# EAGLE design PassiveLPG (EAGLE 8.0.2)
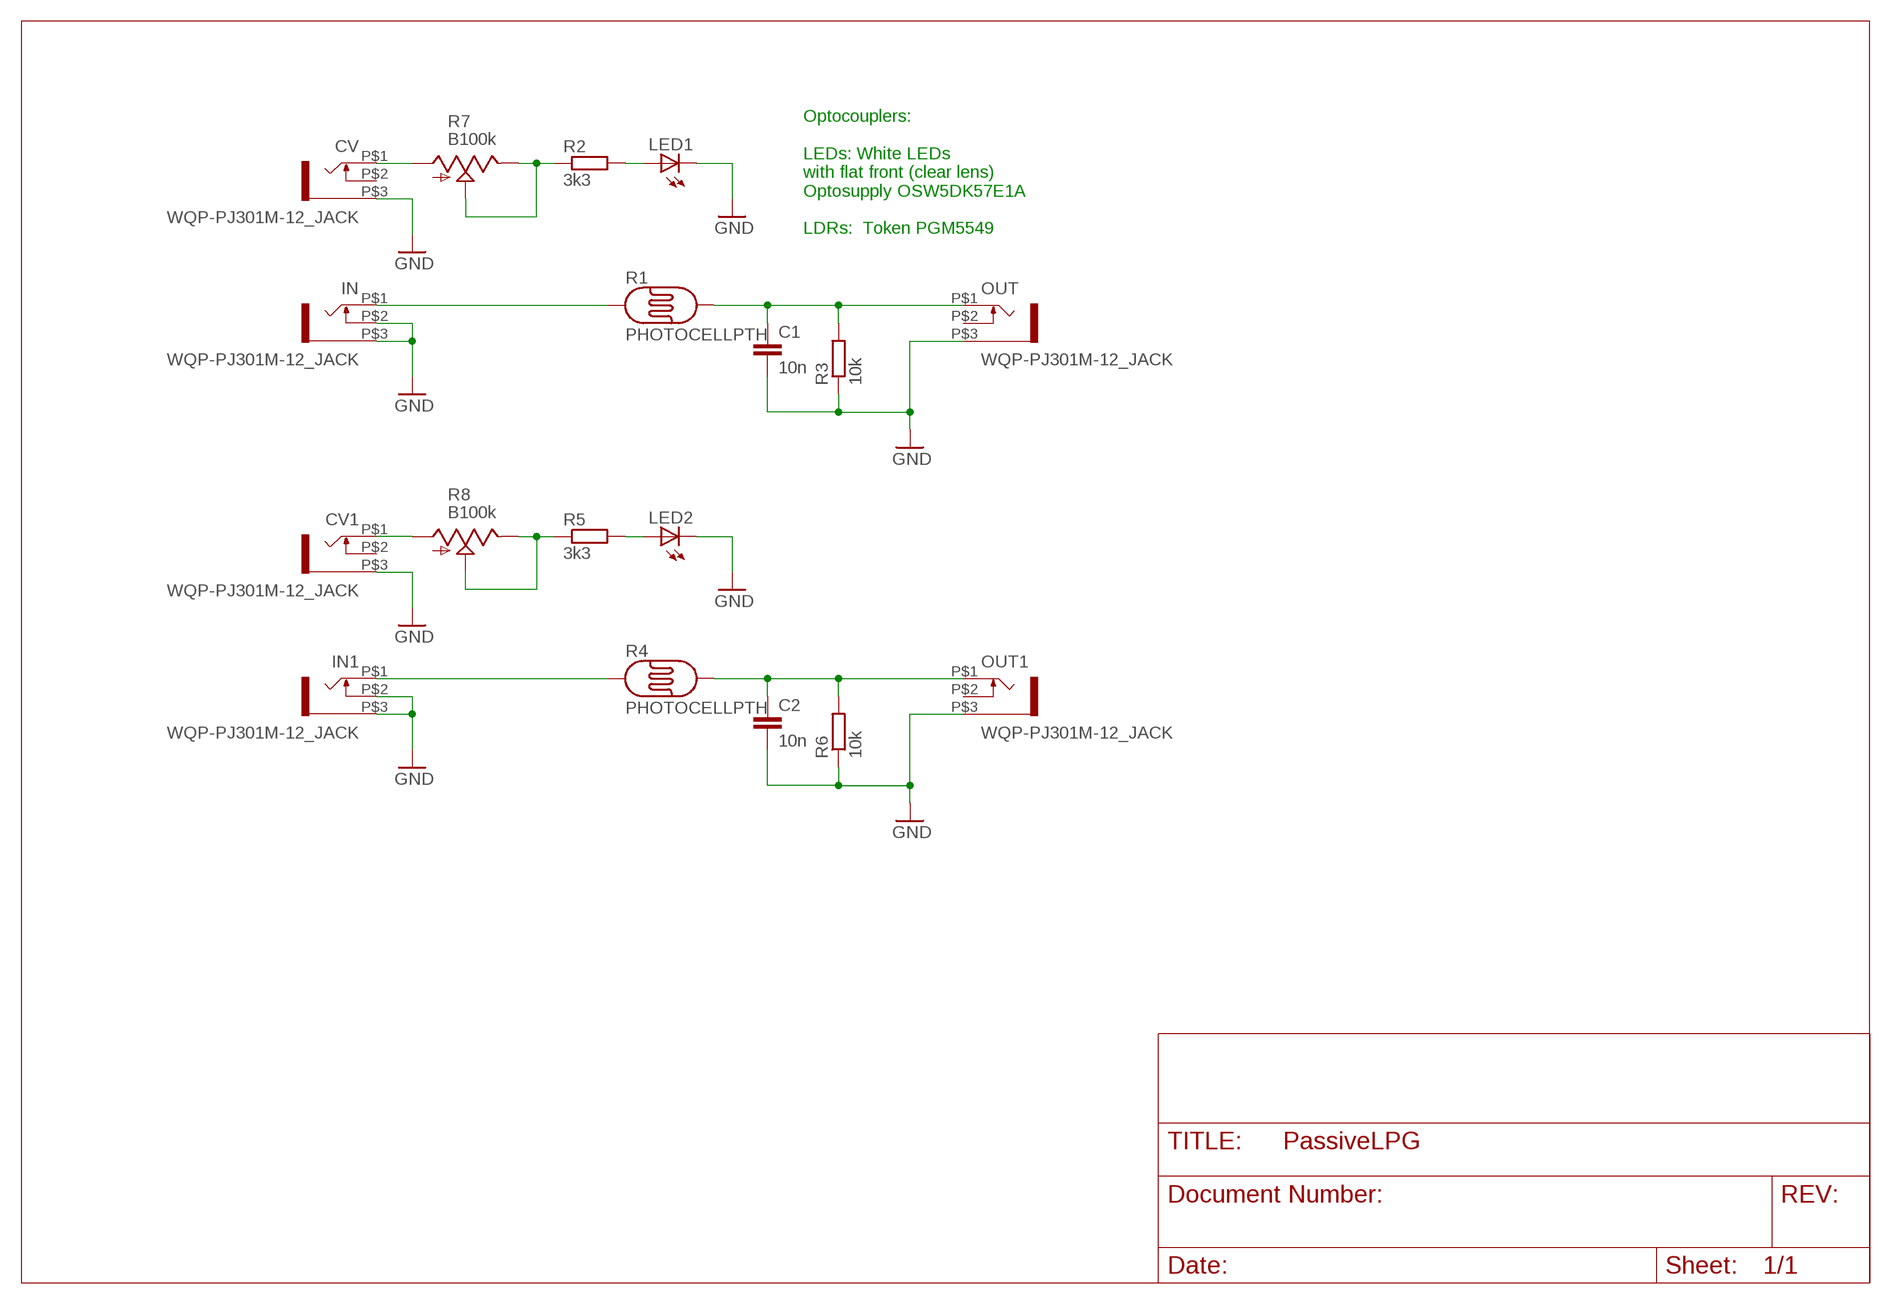
[diagram p0: schematic, sheet 1]

## Parts
C1  10n  C-EU050-025X075  [C050-025X075]
C2  10n  C-EU050-025X075  [C050-025X075]
CV  WQP-PJ301M-12_JACK  [WQP-PJ301M-12_JACK]
CV1  WQP-PJ301M-12_JACK  [WQP-PJ301M-12_JACK]
IN  WQP-PJ301M-12_JACK  [WQP-PJ301M-12_JACK]
IN1  WQP-PJ301M-12_JACK  [WQP-PJ301M-12_JACK]
LED1  LED5MM  [LED5MM]
LED2  LED5MM  [LED5MM]
OUT  WQP-PJ301M-12_JACK  [WQP-PJ301M-12_JACK]
OUT1  WQP-PJ301M-12_JACK  [WQP-PJ301M-12_JACK]
R1  PHOTOCELLPTH  [PHOTOCELL]
R2  3k3  R-EU_0207/7  [0207/7]
R3  10k  R-EU_0207/7  [0207/7]
R4  PHOTOCELLPTH  [PHOTOCELL]
R5  3k3  R-EU_0207/7  [0207/7]
R6  10k  R-EU_0207/7  [0207/7]
R7  B100k  POT_USVERTICAL  [ALPS_POT_VERTICAL]
R8  B100k  POT_USVERTICAL  [ALPS_POT_VERTICAL]

## Nets
GND: C1.2 C2.2 CV1.P$3 CV.P$3 IN1.P$2 IN1.P$3 IN.P$2 IN.P$3 LED1.K(C) LED2.K(C) OUT1.P$3 OUT.P$3 R3.1 R6.1
N$1: CV.P$1 R7.P$3(A)
N$2: R2.1 R7.P$1(E) R7.P$2(S)
N$4: IN.P$1 R1.1
N$5: C1.1 OUT.P$1 R1.2 R3.2
N$6: LED1.A R2.2
N$7: IN1.P$1 R4.1
N$8: C2.1 OUT1.P$1 R4.2 R6.2
N$9: R5.1 R8.P$1(E) R8.P$2(S)
N$10: CV1.P$1 R8.P$3(A)
N$11: LED2.A R5.2
Unconnected: CV1.P$2 CV.P$2 OUT1.P$2 OUT.P$2

## Notes on the sheet
- Optocouplers:
  
  LEDs: White LEDs
  with flat front (clear lens)
  Optosupply OSW5DK57E1A
  
  LDRs:  Token PGM5549

## Library data of the parts
C1 C2 = rcl:C-EU: CAPACITOR, European symbol
CV CV1 IN IN1 OUT OUT1 = thonkiconn:WQP-PJ301M-12_JACK
LED1 LED2 = led:LED: LED OSRAM: - CHIPLED LG R971, LG N971, LY N971, LG Q971, LY Q971, LO R971, LY R971 LH N974, LH R974 LS Q976, LO Q976, LY Q976 LO Q996 - Hyper CHIPLED LW Q18S LB Q993, LB Q99A, LB R99A - SideLED LS A670, LO A670, LY A670, LG A670, LP A670 LB A673, LV A673, LT A673, LW A673 LH A674 LY A675 LS A676, LA A676, LO A676, LY A676, LW A676 LS A679, LY A679, LG A679 - Hyper Micro SIDELED® LS Y876, LA Y876, LO Y876, LY Y876 LT Y87S - SmartLED LW L88C, LW L88S LB L89C, LB L89S, LG L890 LS L89K, LO L89K, LY L89K LS L896, LA L896, LO L896, LY L896 - TOPLED LS T670, LO T670, LY T670, LG T670, LP T670 LSG T670, LSP T670, LSY T670, LOP T670, LYG T670 LG T671, LOG T671, LSG T671 LB T673, LV T673, LT T673, LW T673 LH T674 LS T676, LA T676, LO T676, LY T676, LB T676, LH T676, LSB T676, LW T676 LB T67C, LV T67C, LT T67C, LS T67K, LO T67K, LY T67K, LW E67C LS E67B, LA E67B, LO E67B, LY E67B, LB E67C, LV E67C, LT E67C LW T67C LS T679, LY T679, LG T679 LS T770, LO T770, LY T770, LG T770, LP T770 LB T773, LV T773, LT T773, LW T773 LH T774 LS E675, LA E675, LY E675, LS T675 LS T776, LA T776, LO T776, LY T776, LB T776 LHGB T686 LT T68C, LB T68C - Hyper Mini TOPLED® LB M676 - Mini TOPLED Santana® LG M470 LS M47K, LO M47K, LY M47K Source: http://www.osram.convergy.de LUXEON: - LUMILED® LXK2-PW12-R00, LXK2-PW12-S00, LXK2-PW14-U00, LXK2-PW14-V00 LXK2-PM12-R00, LXK2-PM12-S00, LXK2-PM14-U00 LXK2-PE12-Q00, LXK2-PE12-R00, LXK2-PE12-S00, LXK2-PE14-T00, LXK2-PE14-U00 LXK2-PB12-K00, LXK2-PB12-L00, LXK2-PB12-M00, LXK2-PB14-N00, LXK2-PB14-P00, LXK2-PB14-Q00 LXK2-PR12-L00, LXK2-PR12-M00, LXK2-PR14-Q00, LXK2-PR14-R00 LXK2-PD12-Q00, LXK2-PD12-R00, LXK2-PD12-S00 LXK2-PH12-R00, LXK2-PH12-S00 LXK2-PL12-P00, LXK2-PL12-Q00, LXK2-PL12-R00 Source: www.luxeon.com KINGBRIGHT: KA-3528ASYC Source: www.kingbright.com
R1 R4 = SparkFun-Sensors:PHOTOCELL: CdS photoresistor. This is a low cost way to detect light levels. Resistance decreases with more incoming light. SparkFun SKU: SEN-09088
R2 R3 R5 R6 = rcl:R-EU_: RESISTOR, European symbol
R7 R8 = pot-alps:POT_US

## Board
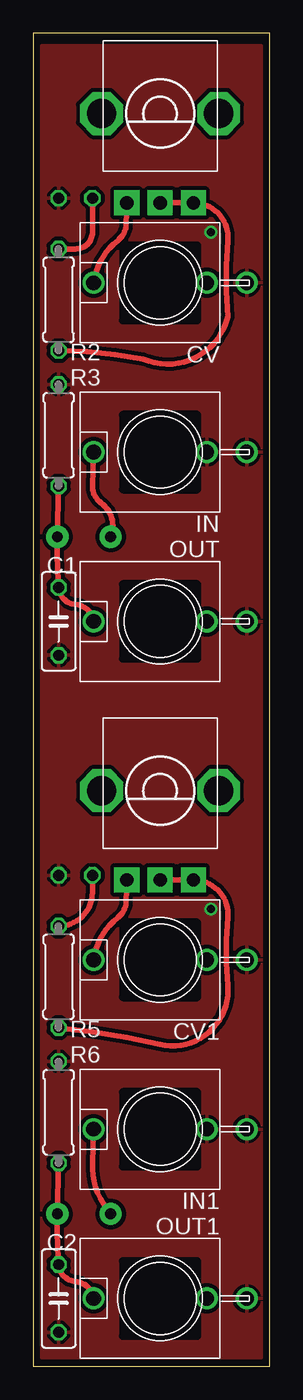
[diagram p1: board, top side]
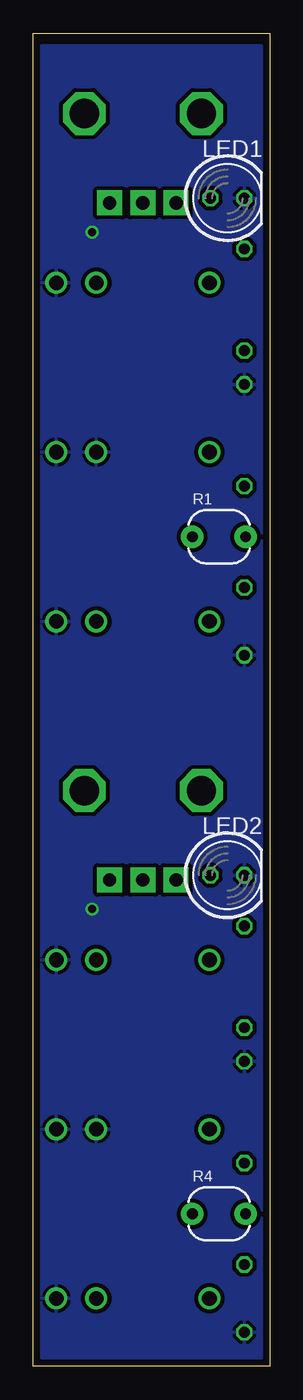
[diagram p2: board, bottom side, seen from below]

Size 17.76 x 100 mm. Coordinates in mm from the lower left corner, seen from the top.
Outline: 0,0 17.76,0 17.76,100 0,100 0,0
Copper layers (1*16): Top 0.0356mm / dielectric 1.5011mm / Bottom 0.0356mm
Design rules "Laen OSH Park PCBOrder": minimum track width 6mil, minimum drill 13mil, track to track 6mil, track to pad 6mil, pad to pad 6mil, via to via 6mil, smd to smd 6mil, copper to edge 15mil, drill to drill 6mil, minimum pad ring 7mil, minimum via ring 7mil, stop-mask expansion 3mil, vias tented up to drill 0mil, thermal gap 10mil

### Footprints (pad centres in the part's own frame; a part is rotated, then mirrored left to right if it is on the bottom)
C050-025X075 = drill 0.813 octagon: 1 -2.54,0; 2 2.54,0
WQP-PJ301M-12_JACK = drill 1.1: P$1 0,5; P$2 0,-3.5; P$3 0,-6.5
LED5MM = drill 0.813 octagon: A -1.27,0; K 1.27,0
PHOTOCELL = drill 0.8 pad 1.676: 1 -2,0; 2 2,0
0207/7 = drill 0.813 octagon: 1 -3.81,0; 2 3.81,0
ALPS_POT_VERTICAL = drill 1 pad 1.88 square: P$1 -2.5,6.7; P$2 0,6.7; P$3 2.5,6.7 | drill 2.2 pad 3.175 octagon: P$4 -4.4,0; P$5 4.4,0

### Placement (x,y rotation side)
C1  1.9,55.88 270 top
C2  1.9,5.08 270 top
CV  9.53,81.28 90 top
CV1  9.53,30.48 90 top
IN  9.53,68.58 90 top
IN1  9.53,17.78 90 top
LED1  3.18,87.63 0 bottom
LED2  3.18,36.83 0 bottom
OUT  9.53,55.88 90 top
OUT1  9.53,5.08 90 top
R1  3.81,62.23 0 bottom
R2  1.9,80.01 90 top
R3  1.9,69.85 270 top
R4  3.81,11.43 0 bottom
R5  1.9,29.21 90 top
R6  1.9,19.05 270 top
R7  9.53,93.98 180 top
R8  9.53,43.18 180 top

### Tracks (layer width: path | path; a pad name or v marks a point on that pad's centre or on a via)
GND  (via drill 0.6)
  other vias: 13.33,34.29 13.33,85.09
  pour Bottom (isolate 0.305): 0.63,99.06 17.15,99.06 17.15,0.64 0.63,0.64
  pour Top (isolate 0.305): 0.63,99.06 17.15,99.06 17.15,0.64 0.63,0.64
N$1
  Top 0.406: R7.P$3 6.99,85.72 arc-50 6.35,84.45 arc44 CV.P$1
N$2
  Top 0.406: R7.P$2 R7.P$1 arc-95 14.6,84.45 arc10 14.6,78.74 arc-100 8.26,75.56 arc10 R2.1
N$4
  Top 0.406: IN.P$1 4.45,66.04 arc57 5.08,64.77 arc-78 R1.1
N$5
  Top 0.406: R3.2 R1.2 arc6 C1.1 arc81 3.18,57.15 arc-78 OUT.P$1
N$6
  Top 0.406: LED1.A 4.45,85.09 arc-90 3.18,83.82 R2.2
N$7
  Top 0.406: IN1.P$1 4.45,15.24 arc43 R4.1
N$8
  Top 0.406: R6.2 R4.2 arc6 C2.1 arc81 3.18,6.35 arc-78 OUT1.P$1
N$9
  Top 0.406: R8.P$2 R8.P$1 arc-95 14.6,33.66 arc10 14.6,28.57 arc-108 9.53,24.13 arc7 R5.1
N$10
  Top 0.406: R8.P$3 6.99,34.92 arc-50 6.35,33.66 arc44 CV1.P$1
N$11
  Top 0.406: LED2.A 4.45,35.56 arc-90 R5.2